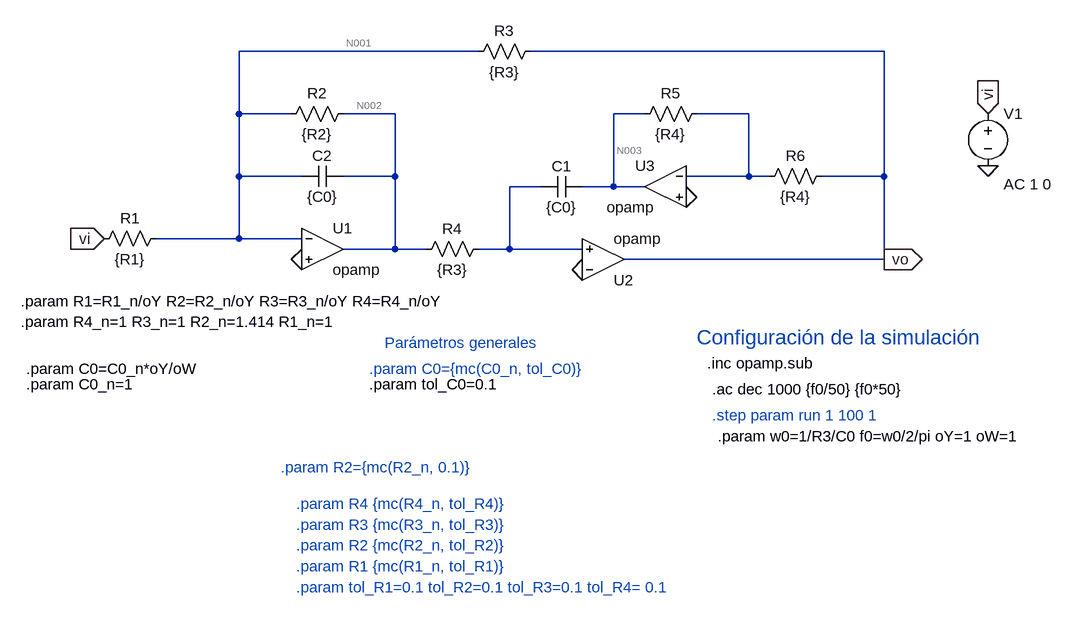
[diagram p0: schematic ack_moss_bicuad.asc]
ack_moss_bicuad.asc, the LTspice schematic file:
Version 4
SHEET 1 2172 1280
WIRE 384 -48 16 -48
WIRE 1008 -48 464 -48
WIRE 16 48 16 -48
WIRE 96 48 16 48
WIRE 256 48 176 48
WIRE 640 48 592 48
WIRE 800 48 720 48
WIRE 16 144 16 48
WIRE 112 144 16 144
WIRE 256 144 256 48
WIRE 256 144 176 144
WIRE 800 144 800 48
WIRE 800 144 704 144
WIRE 832 144 800 144
WIRE 1008 144 1008 -48
WIRE 1008 144 912 144
WIRE 480 160 432 160
WIRE 592 160 592 48
WIRE 592 160 544 160
WIRE 640 160 592 160
WIRE 16 240 16 144
WIRE 16 240 -112 240
WIRE 112 240 16 240
WIRE 256 256 256 144
WIRE 256 256 176 256
WIRE 304 256 256 256
WIRE 432 256 432 160
WIRE 432 256 384 256
WIRE 544 256 432 256
WIRE 1008 272 1008 144
WIRE 1008 272 608 272
FLAG 544 288 0
FLAG 112 272 0
FLAG 704 176 0
FLAG 1008 272 vo
IOPIN 1008 272 Out
FLAG -192 240 vi
IOPIN -192 240 In
FLAG 1168 128 0
FLAG 1168 48 vi
IOPIN 1168 48 In
SYMBOL res -96 224 R90
WINDOW 0 0 56 VBottom 2
WINDOW 3 32 56 VTop 2
SYMATTR InstName R1
SYMATTR Value {R1}
SYMBOL res 192 32 R90
WINDOW 0 0 56 VBottom 2
WINDOW 3 32 56 VTop 2
SYMATTR InstName R2
SYMATTR Value {R2}
SYMBOL res 480 -64 R90
WINDOW 0 0 56 VBottom 2
WINDOW 3 32 56 VTop 2
SYMATTR InstName R3
SYMATTR Value {R3}
SYMBOL res 400 240 R90
WINDOW 0 0 56 VBottom 2
WINDOW 3 32 56 VTop 2
SYMATTR InstName R4
SYMATTR Value {R3}
SYMBOL res 736 32 R90
WINDOW 0 0 56 VBottom 2
WINDOW 3 32 56 VTop 2
SYMATTR InstName R5
SYMATTR Value {R4}
SYMBOL res 928 128 R90
WINDOW 0 0 56 VBottom 2
WINDOW 3 32 56 VTop 2
SYMATTR InstName R6
SYMATTR Value {R4}
SYMBOL cap 544 144 R90
WINDOW 0 0 32 VBottom 2
WINDOW 3 32 32 VTop 2
SYMATTR InstName C1
SYMATTR Value {C0}
SYMBOL cap 176 128 R90
WINDOW 0 0 32 VBottom 2
WINDOW 3 32 32 VTop 2
SYMATTR InstName C2
SYMATTR Value {C0}
SYMBOL OpAmps\\opamp 144 192 R0
SYMATTR InstName U1
SYMBOL OpAmps\\opamp 576 336 M180
SYMATTR InstName U2
SYMBOL OpAmps\\opamp 672 96 M0
SYMATTR InstName U3
SYMBOL voltage 1168 32 R0
WINDOW 123 24 124 Left 2
WINDOW 39 0 0 Left 0
SYMATTR InstName V1
SYMATTR Value ""
SYMATTR Value2 AC 1 0
TEXT 736 432 Left 2 !.inc opamp.sub
TEXT 744 472 Left 2 !.ac dec 1000 {f0/50} {f0*50}
TEXT 104 680 Left 2 ;.param R3 {mc(R3_n, tol_R3)}
TEXT 720 392 Left 3 ;Configuración de la simulación
TEXT 240 400 Left 2 ;Parámetros generales
TEXT 104 712 Left 2 ;.param R2 {mc(R2_n, tol_R2)}
TEXT 104 744 Left 2 ;.param R1 {mc(R1_n, tol_R1)}
TEXT 104 648 Left 2 ;.param R4 {mc(R4_n, tol_R4)}
TEXT 216 440 Left 2 ;.param C0={mc(C0_n, tol_C0)}
TEXT 104 776 Left 2 ;.param tol_R1=0.1 tol_R2=0.1 tol_R3=0.1 tol_R4= 0.1
TEXT 216 464 Left 2 !.param tol_C0=0.1
TEXT -320 368 Left 2 !.param R4_n=1 R3_n=1 R2_n=1.414 R1_n=1
TEXT -312 464 Left 2 !.param C0_n=1
TEXT 744 512 Left 2 ;.step param run 1 100 1
TEXT 752 544 Left 2 !.param w0=1/R3/C0 f0=w0/2/pi oY=1 oW=1
TEXT -320 336 Left 2 !.param R1=R1_n/oY R2=R2_n/oY R3=R3_n/oY R4=R4_n/oY
TEXT 80 592 Left 2 ;.param R2={mc(R2_n, 0.1)}
TEXT -312 440 Left 2 !.param C0=C0_n*oY/oW

The netlist it stands for:
* ack_moss_bicuad.asc
R1 N001 vi {R1}
R2 N002 N001 {R2}
R3 vo N001 {R3}
R4 N005 N002 {R3}
R5 N004 N003 {R4}
R6 vo N004 {R4}
C1 N003 N005 {C0}
C2 N002 N001 {C0}
XU1 N001 0 N002 opamp Aol=100K GBW=10Meg  ; pins invin noninvin out
XU2 0 N005 vo opamp Aol=100K GBW=10Meg  ; pins invin noninvin out
XU3 N004 0 N003 opamp Aol=100K GBW=10Meg  ; pins invin noninvin out
V1 vi 0 AC 1 0
.inc opamp.sub
.ac dec 1000 {f0/50} {f0*50}
* .param R3 {mc(R3_n, tol_R3)}
* Configuración de la simulación
* Parámetros generales
* .param R2 {mc(R2_n, tol_R2)}
* .param R1 {mc(R1_n, tol_R1)}
* .param R4 {mc(R4_n, tol_R4)}
* .param C0={mc(C0_n, tol_C0)}
* .param tol_R1=0.1 tol_R2=0.1 tol_R3=0.1 tol_R4= 0.1
.param tol_C0=0.1
.param R4_n=1 R3_n=1 R2_n=1.414 R1_n=1
.param C0_n=1
* .step param run 1 100 1
.param w0=1/R3/C0 f0=w0/2/pi oY=1 oW=1
.param R1=R1_n/oY R2=R2_n/oY R3=R3_n/oY R4=R4_n/oY
* .param R2={mc(R2_n, 0.1)}
.param C0=C0_n*oY/oW
.backanno
.end

* Results of the author's LTspice run, read from the files saved beside the schematic
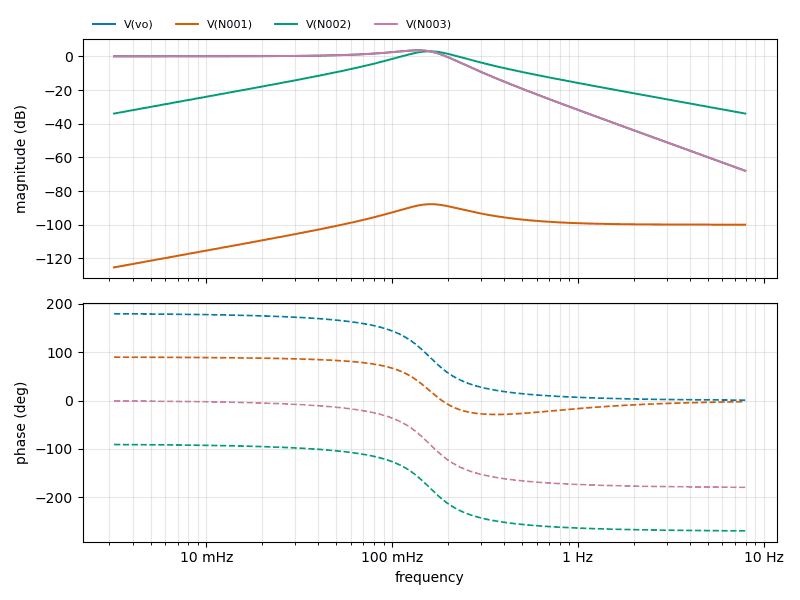
[diagram p1: AC Analysis of ack_moss_bicuad.asc, plotted from the saved traces]
* AC Analysis, 1 run:
*   V(vo): 0.00 dB at 3.183 mHz, -67.96 dB at 7.958 Hz, peak 3.59 dB at 137.7 mHz, 3 dB below the peak at 47.28 mHz and 189.1 mHz
*   V(N001): -125.33 dB at 3.183 mHz, -99.97 dB at 7.958 Hz, peak -87.78 dB at 161.8 mHz, 3 dB below the peak at 114.9 mHz and 235.1 mHz
*   V(N002): -33.98 dB at 3.183 mHz, -33.98 dB at 7.958 Hz, peak 3.01 dB at 159.2 mHz, 3 dB below the peak at 112.5 mHz and 225.1 mHz
*   V(N003): 0.00 dB at 3.183 mHz, -67.96 dB at 7.958 Hz, peak 3.59 dB at 137.7 mHz, 3 dB below the peak at 47.28 mHz and 189.1 mHz